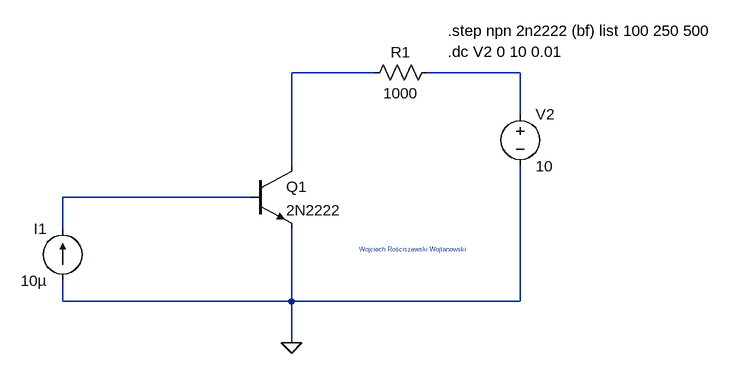
[diagram p0: schematic Bipolar Transistor.asc]
Bipolar Transistor.asc, the LTspice schematic file:
Version 4
SHEET 1 880 680
WIRE 0 -432 -128 -432
WIRE 224 -432 80 -432
WIRE 224 -368 224 -432
WIRE -128 -288 -128 -432
WIRE -192 -240 -480 -240
WIRE -480 -192 -480 -240
WIRE -480 -80 -480 -112
WIRE -128 -80 -128 -192
WIRE -128 -80 -480 -80
WIRE 224 -80 224 -288
WIRE 224 -80 -128 -80
WIRE -128 -16 -128 -80
FLAG -128 -16 0
SYMBOL voltage 224 -384 R0
WINDOW 123 0 0 Left 0
WINDOW 39 0 0 Left 0
SYMATTR InstName V2
SYMATTR Value 10
SYMBOL npn -192 -288 R0
SYMATTR InstName Q1
SYMATTR Value 2N2222
SYMBOL res 96 -448 R90
WINDOW 0 0 56 VBottom 2
WINDOW 3 32 56 VTop 2
SYMATTR InstName R1
SYMATTR Value 1000
SYMBOL current -480 -112 R180
WINDOW 0 24 80 Left 2
WINDOW 3 24 0 Left 2
WINDOW 123 0 0 Left 0
WINDOW 39 0 0 Left 0
SYMATTR InstName I1
SYMATTR Value 10µ
TEXT 112 -464 Left 2 !.dc V2 0 10 0.01
TEXT -24 -160 Left 0 ;Wojciech Rościszewski Wojtanowski
TEXT 112 -496 Left 2 !.step npn 2n2222 (bf) list 100 250 500

The netlist it stands for:
* Bipolar Transistor.asc
V2 N002 0 10
Q1 N001 N003 0 0 2N2222
R1 N002 N001 1000
I1 0 N003 10µ
.model NPN NPN
.model PNP PNP
.lib standard.bjt
.dc V2 0 10 0.01
* Wojciech Rościszewski Wojtanowski
.step npn 2n2222 (bf) list 100 250 500
.backanno
.end